# EAGLE design FrontPanel-IN14 (EAGLE 9.5.1)
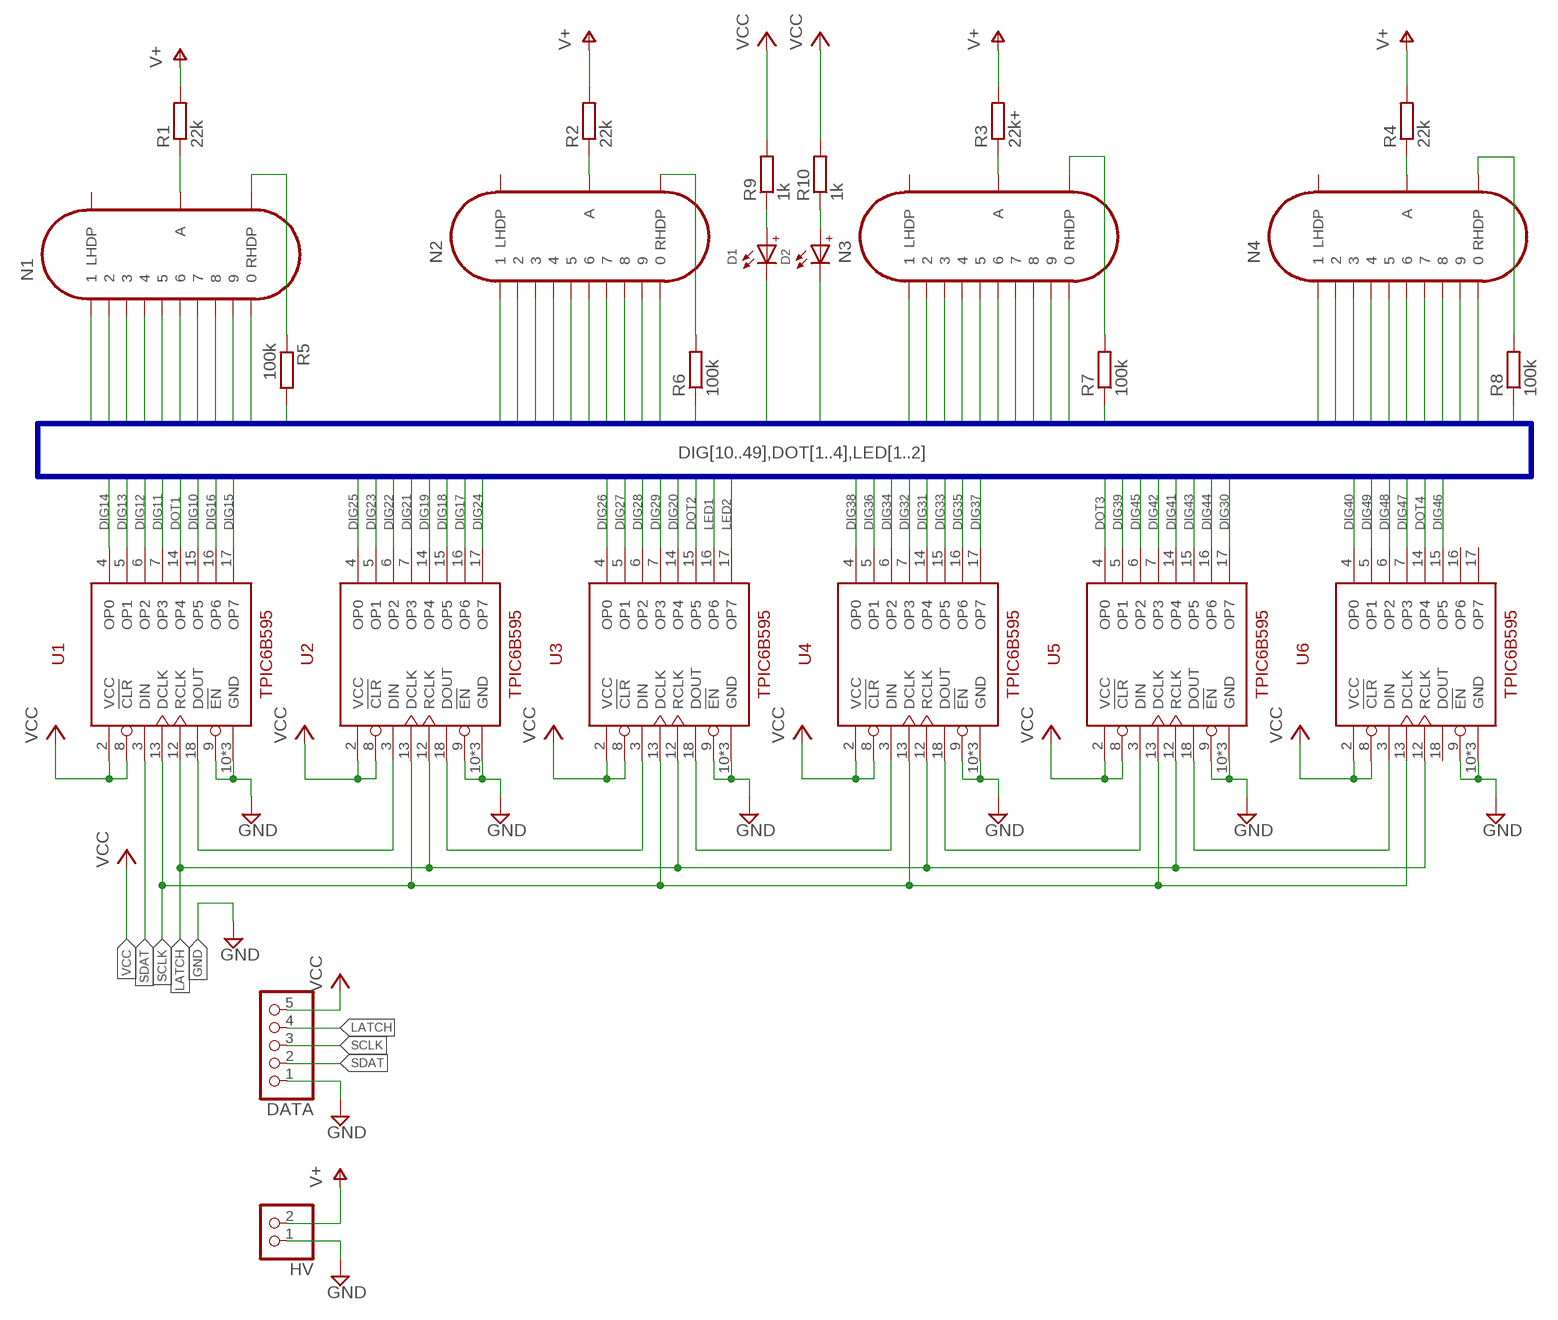
[diagram p0: schematic, sheet 1]

## Parts
D1  RED/AMBER  WL-SITW_3528_15414185BA210  [WL-SITW_154141XXBA210]
D2  RED/AMBER  WL-SITW_3528_15414185BA210  [WL-SITW_154141XXBA210]
DATA  .1" Header  PINHD-1X5  [1X05]
HV  .1" Header  PINHD-1X2  [1X02]
N1  IN-14  [IN-14]
N2  IN-14  [IN-14]
N3  IN-14  [IN-14]
N4  IN-14  [IN-14]
R1  22k  R-EU_0207/10  [0207/10]
R2  22k  R-EU_0207/10  [0207/10]
R3  22k+  R-EU_0207/10  [0207/10]
R4  22k  R-EU_0207/10  [0207/10]
R5  100k  R-EU_0207/10  [0207/10]
R6  100k  R-EU_0207/10  [0207/10]
R7  100k  R-EU_0207/10  [0207/10]
R8  100k  R-EU_0207/10  [0207/10]
R9  1k  R-EU_0207/10  [0207/10]
R10  1k  R-EU_0207/10  [0207/10]
U1  TPIC6B595N  [PDIP-20]
U2  TPIC6B595N  [PDIP-20]
U3  TPIC6B595N  [PDIP-20]
U4  TPIC6B595N  [PDIP-20]
U5  TPIC6B595N  [PDIP-20]
U6  TPIC6B595N  [PDIP-20]

## Nets
DIG10: N1.0 U1.15(OP5)
DIG11: N1.1 U1.7(OP3)
DIG12: N1.2 U1.6(OP2)
DIG13: N1.3 U1.5(OP1)
DIG14: N1.4 U1.4(OP0)
DIG15: N1.5 U1.17(OP7)
DIG16: N1.6 U1.16(OP6)
DIG17: N1.7 U2.16(OP6)
DIG18: N1.8 U2.15(OP5)
DIG19: N1.9 U2.14(OP4)
DIG20: N2.0 U3.14(OP4)
DIG21: N2.1 U2.7(OP3)
DIG22: N2.2 U2.6(OP2)
DIG23: N2.3 U2.5(OP1)
DIG24: N2.4 U2.17(OP7)
DIG25: N2.5 U2.4(OP0)
DIG26: N2.6 U3.4(OP0)
DIG27: N2.7 U3.5(OP1)
DIG28: N2.8 U3.6(OP2)
DIG29: N2.9 U3.7(OP3)
DIG30: N3.0 U5.17(OP7)
DIG31: N3.1 U4.14(OP4)
DIG32: N3.2 U4.7(OP3)
DIG33: N3.3 U4.15(OP5)
DIG34: N3.4 U4.6(OP2)
DIG35: N3.5 U4.16(OP6)
DIG36: N3.6 U4.5(OP1)
DIG37: N3.7 U4.17(OP7)
DIG38: N3.8 U4.4(OP0)
DIG39: N3.9 U5.5(OP1)
DIG40: N4.0 U6.4(OP0)
DIG41: N4.1 U5.14(OP4)
DIG42: N4.2 U5.7(OP3)
DIG43: N4.3 U5.15(OP5)
DIG44: N4.4 U5.16(OP6)
DIG45: N4.5 U5.6(OP2)
DIG46: N4.6 U6.15(OP5)
DIG47: N4.7 U6.7(OP3)
DIG48: N4.8 U6.6(OP2)
DIG49: N4.9 U6.5(OP1)
DOT1: R5.2 U1.14(OP4)
DOT2: R6.1 U3.15(OP5)
DOT3: R7.1 U5.4(OP0)
DOT4: R8.1 U6.14(OP4)
GND: DATA.1 HV.1 U1.9(!EN) U1.10(GND) U1.11(GND) U1.19(GND) U2.9(!EN) U2.10(GND) U2.11(GND) U2.19(GND) U3.9(!EN) U3.10(GND) U3.11(GND) U3.19(GND) U4.9(!EN) U4.10(GND) U4.11(GND) U4.19(GND) U5.9(!EN) U5.10(GND) U5.11(GND) U5.19(GND) U6.9(!EN) U6.10(GND) U6.11(GND) U6.19(GND)
LATCH: DATA.4 U1.12(RCLK) U2.12(RCLK) U3.12(RCLK) U4.12(RCLK) U5.12(RCLK) U6.12(RCLK)
LED1: D1.2(-) U3.16(OP6)
LED2: D2.2(-) U3.17(OP7)
N$45: N1.RHDP R5.1
N$46: N2.RHDP R6.2
N$47: N3.RHDP R7.2
N$48: N4.RHDP R8.2
N$49: N1.A R1.1
N$50: N2.A R2.1
N$51: N3.A R3.1
N$52: N4.A R4.1
N$55: U1.18(DOUT) U2.3(DIN)
N$56: U2.18(DOUT) U3.3(DIN)
N$57: U3.18(DOUT) U4.3(DIN)
N$58: U4.18(DOUT) U5.3(DIN)
N$59: U5.18(DOUT) U6.3(DIN)
N$66: D1.1(+) R9.1
N$67: D2.1(+) R10.1
SCLK: DATA.3 U1.13(DCLK) U2.13(DCLK) U3.13(DCLK) U4.13(DCLK) U5.13(DCLK) U6.13(DCLK)
SDAT: DATA.2 U1.3(DIN)
V+: HV.2 R1.2 R2.2 R3.2 R4.2
VCC: DATA.5 R9.2 R10.2 U1.2(VCC) U1.8(!CLR) U2.2(VCC) U2.8(!CLR) U3.2(VCC) U3.8(!CLR) U4.2(VCC) U4.8(!CLR) U5.2(VCC) U5.8(!CLR) U6.2(VCC) U6.8(!CLR)
Unconnected: N1.LHDP N2.LHDP N3.LHDP N4.LHDP U6.16(OP6) U6.17(OP7) U6.18(DOUT)

## Buses
DIG[10..49],DOT[1..4],LED[1..2]

## Library data of the parts
D1 D2 = Wurth_Elektronik_Optoelectronics_rev18a:WL-SITW_3528: WL-SITW SMD Infrared TOP LED Waterclear Characteristics Standard size 3528 Low energy consumption High reliability Low current requirement Fast switching IR Emitter Applications Infrared sensor Distance measure Remote control IR Lightbarrier Smoke detector <http://katalog.we-online.de/media/images/v2/Family_SITW-3528_15414185BA220.jpg> Details see: http://katalog.we-online.de/en/led/WL-SITW?m Created By Yingchun Shan 2018-03-09 2018 (C) Wurth Elektronik
DATA = pinhead:PINHD-1X5: PIN HEADER
HV = pinhead:PINHD-1X2: PIN HEADER
N1-N4 = NixieClock:IN-14: IN-14: medium numeric frontview nixie tube
R1-R10 = rcl:R-EU_: RESISTOR, European symbol; SPICEPREFIX: R
U1-U6 = NixieClock:TPIC6B595

## Board
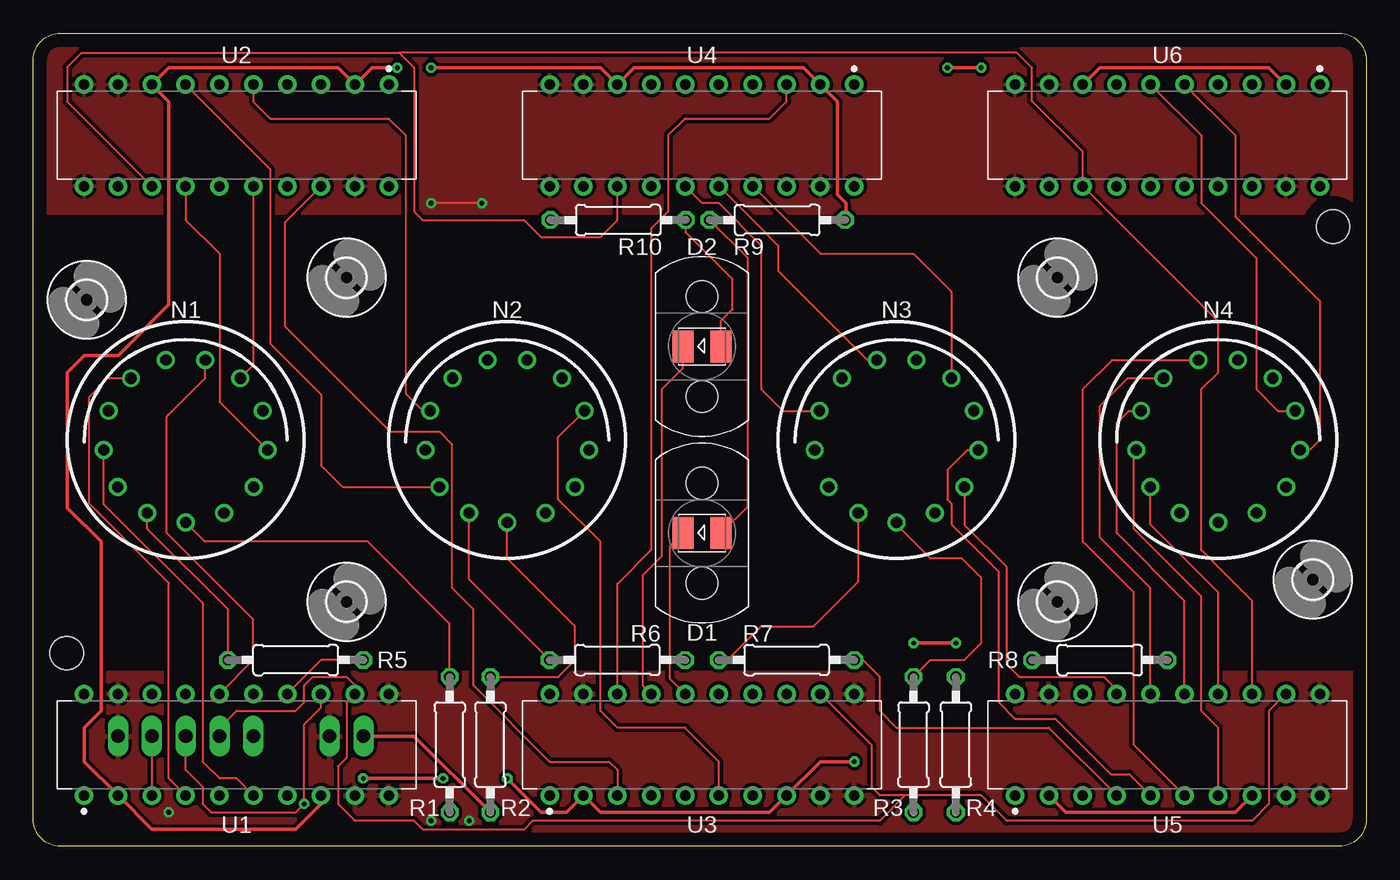
[diagram p1: board, top side]
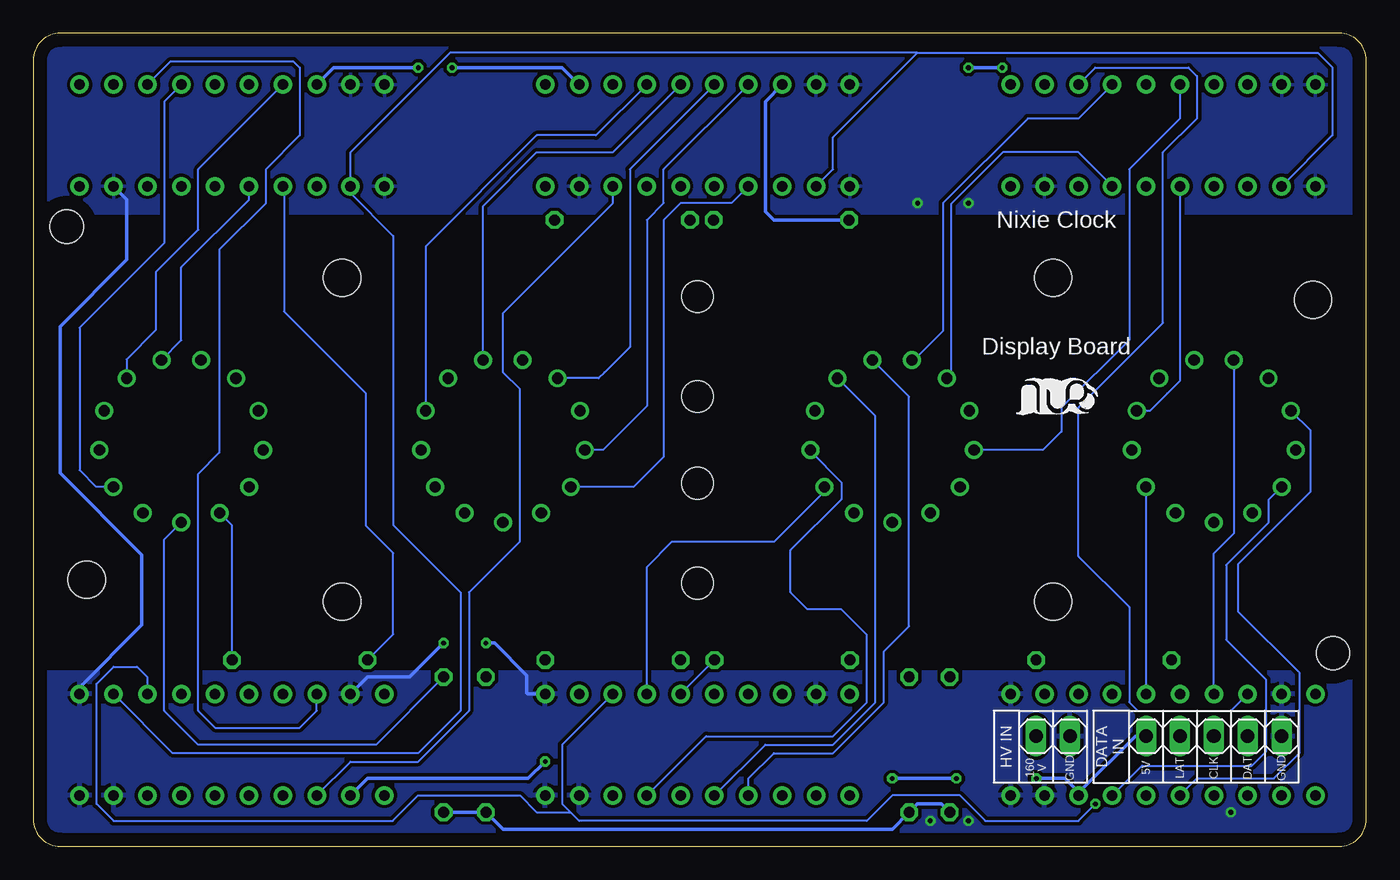
[diagram p2: board, bottom side, seen from below]

Size 100 x 61 mm. Coordinates in mm from the lower left corner, seen from the top.
Outline: 2,0 arc-90 0,2 0,59 arc-90 2,61 98,61 arc-90 100,59 100,2 arc-90 98,0 2,0
Copper layers (1*16): Top 0.035mm / dielectric 1.5mm / Bottom 0.035mm
Design rules "2layer": minimum track width 6mil, minimum drill 0.35mm, track to track 8mil, track to pad 8mil, pad to pad 8mil, via to via 8mil, smd to smd 6mil, copper to edge 40mil, drill to drill 6mil, minimum pad ring 10mil, minimum via ring 8mil, stop-mask expansion 4mil, vias tented up to drill 40mil, thermal gap 10mil
Holes 2.5 mm at 97.5,46.5 2.5,14.5

### Footprints (pad centres in the part's own frame; a part is rotated, then mirrored left to right if it is on the bottom)
WL-SITW_154141XXBA210 = smd 1.6 x 2.4: 1 -1.425,0; 2 1.425,0
1X05 = drill 1.016 long: 1 -5.08,0; 2 -2.54,0; 3 0,0; 4 2.54,0; 5 5.08,0
1X02 = drill 1.016 long: 1 -1.27,0; 2 1.27,0
IN-14 = drill 0.84: 0 5.094,-3.516; 1 -5.094,-3.516; 2 -6.145,-0.746; 3 -5.788,2.195; 4 -4.105,4.633; 5 -1.481,6.01; 6 1.481,6.01; 7 4.105,4.633; 8 5.788,2.195; 9 6.145,-0.746; A 0,-6.19; LHDP 2.877,-5.481; RHDP -2.877,-5.481
0207/10 = drill 0.813 octagon: 1 -5.08,0; 2 5.08,0
PDIP-20 = drill 0.786 pad 1.386: 1 -3.81,11.43; 2 -3.81,8.89; 3 -3.81,6.35; 4 -3.81,3.81; 5 -3.81,1.27; 6 -3.81,-1.27; 7 -3.81,-3.81; 8 -3.81,-6.35; 9 -3.81,-8.89; 10 -3.81,-11.43; 11 3.81,-11.43; 12 3.81,-8.89; 13 3.81,-6.35; 14 3.81,-3.81; 15 3.81,-1.27; 16 3.81,1.27; 17 3.81,3.81; 18 3.81,6.35; 19 3.81,8.89; 20 3.81,11.43
2,8 = hole 2.8: 0,0
MENTOR-1216.1005 = hole 2.4: -3.75,0; 3.75,0

### Placement (x,y rotation side)
D1  50.16,23.5 180 top
D2  50.16,37.5 180 top
DATA  11.43,8.26 180 bottom
HV  23.5,8.26 180 bottom
N1  11.43,30.48 0 top
N2  35.56,30.48 0 top
N3  64.77,30.48 0 top
N4  88.9,30.48 0 top
R1  31.24,7.62 270 top
R2  34.29,7.62 270 top
R3  66.04,7.62 270 top
R4  69.22,7.62 270 top
R5  19.68,13.97 0 top
R6  43.81,13.97 180 top
R7  56.52,13.97 180 top
R8  80.01,13.97 0 top
R9  55.81,46.99 0 top
R10  43.88,46.99 180 top
U1  15.24,7.62 90 top
U2  15.24,53.34 270 top
U3  50.16,7.62 90 top
U4  50.16,53.34 270 top
U5  85.09,7.62 90 top
U6  85.09,53.34 270 top
U$1  [2,8]  23.5,42.66 0 top
U$2  [2,8]  4,41 0 top
U$3  [2,8]  23.5,18.34 0 top
U$4  [LOGO-SILKSCREEEN-S]  23.25,33.25 0 bottom
U$5  [MENTOR-1216.1005]  50.16,37.5 90 top
U$6  [MENTOR-1216.1005]  50.16,23.5 90 top
U$7  [2,8]  76.83,18.34 0 top
U$8  [2,8]  76.83,42.66 0 top
U$9  [2,8]  96,20 0 top

### Tracks (layer width: path | path; a pad name or v marks a point on that pad's centre or on a via)
DIG10
  Bottom 0.152: N1.0 U1.15
DIG11
  Bottom 0.152: U1.7 16.83,6.03 8.6,6.03 7.5,7.13 7.5,12.5 10.5,15.5 10.5,21.1 7.34,24.26 7.34,25.96 N1.1
DIG12
  Top 0.152: U1.6 15.24,5.08 13.97,5.08 12.7,6.35 12.7,18.24 5.29,25.66 N1.2
DIG13
  Bottom 0.152: U1.5 12.7,5.08 6.92,5.08 5,7 5,13 9.58,17.58 9.58,21.2 4.17,26.61 4.17,31.21 N1.3
DIG14
  Top 0.152: U1.4 10.16,5.08 10.16,19.74 4.17,25.73 4.17,33.7 5.59,35.11 N1.4
DIG15
  Bottom 0.152: U1.17 11.43,21.97 9.95,23.45 N1.5
DIG16
  Top 0.152: N1.6 12.91,35.14 10.39,32.61 10.16,32.38 10,32.23 10,23.52 16.51,17.01 16.51,13.97 U1.16
DIG17
  Top 0.152: U2.16 16.51,36.09 N1.7
DIG18
  Bottom 0.152: U2.15 13.97,34.92 14.92,33.97 | N1.8 16.22,32.67 14.92,33.97 | 14.92,33.97
DIG19
  Top 0.152: U2.14 11.43,46.99 13.97,44.45 13.97,33.34 N1.9
DIG20
  Bottom 0.152: U3.14 53.98,20.95 52.07,22.86 44.45,22.86 44.44,22.85 40.65,26.64 N2.0
DIG21
  Top 0.152: U2.7 17.78,50.8 17.78,37.72 21.59,33.91 21.59,28.57 23.2,26.96 N2.1
DIG22
  Bottom 0.152: U2.6 13.97,54.61 17.78,50.8 17.78,37.99 22.86,32.91 22.86,31.11 24.24,29.73 N2.2
DIG23
  Top 0.152: U2.5 16.51,55.88 17.78,54.61 26.67,54.61 27.94,53.34 27.94,33.97 29.24,32.67 N2.3
DIG24
  Bottom 0.152: U2.17 21.59,52.07 27.27,52.07 31.11,48.23 31.11,35.45 N2.4
DIG25
  Bottom 0.152: U2.4 21.59,54.61 25.4,54.61 31.75,48.26 31.75,38.67 33.93,36.49 N2.5
DIG26
  Bottom 0.152: U3.4 46.35,5.08 44.45,6.99 40.01,6.99 36.2,10.79 36.2,14.61 34.29,16.51 34.29,33.74 N2.6
DIG27
  Bottom 0.152: U3.5 45.09,7.62 40.01,7.62 36.83,10.79 36.83,32.28 N2.7
DIG28
  Top 0.152: U3.6 51.44,6.35 48.9,8.89 43.81,8.89 42.55,10.16 42.55,22.86 39.37,26.04 39.37,30.7 N2.8
DIG29
  Bottom 0.152: U3.7 49.53,8.26 40.01,8.26 37.47,10.79 37.47,15.88 39.37,17.78 41.91,17.78 43.18,19.05 43.18,22.23 39.37,26.04 39.37,27.3 41.7,29.64 N2.9
DIG30
  Top 0.152: U5.17 81.28,11.75 80.33,12.7 73.98,12.7 73.03,13.65 73.03,20.95 69.86,24.12 N3.0
DIG31
  Bottom 0.152: U4.14 47.62,48.26 51.44,48.26 52.7,46.99 52.7,29.21 54.95,26.96 N3.1
DIG32
  Bottom 0.152: U4.7 52.7,50.8 52.7,48.26 53.98,46.99 53.98,33.02 57.26,29.73 N3.2
DIG33
  Top 0.152: U4.15 50.16,48.26 51.44,48.26 54.61,45.09 54.61,34.29 56.23,32.67 N3.3
DIG34
  Bottom 0.152: U4.6 55.24,50.8 55.24,37.47 57.15,35.56 57.59,35.12 57.6,35.11 N3.4
DIG35
  Top 0.152: U4.16 54.29,46.67 55.88,45.09 55.88,43.18 62.57,36.49 N3.5
DIG36
  Bottom 0.152: U4.5 56.52,52.07 62.23,52.07 66.25,48.05 N3.6
DIG37
  Top 0.152: U4.17 59.05,44.45 66.04,44.45 68.88,41.62 N3.7
DIG38
  Bottom 0.152: U4.4 57.78,53.34 62.23,53.34 70.56,45.01 N3.8
DIG39
  Top 0.152: N3.9 70.09,29.73 68.58,28.22 68.58,26.04 68.9,25.72 68.9,24.13 72.39,20.64 72.39,10.83 73.66,9.56 76.67,9.56 80.83,5.4 82.23,5.4 U5.5
DIG40
  Bottom 0.152: U6.4 90.17,55.88 90.17,45.26 96.52,38.91 96.52,28.22 95.26,26.96 N4.0
DIG41
  Top 0.152: U5.14 88.9,19.05 83.81,24.14 N4.1
DIG42
  Top 0.152: U5.7 88.9,8.89 87.63,10.16 87.63,18.73 82.55,23.81 82.55,29.53 N4.2
DIG43
  Top 0.152: U5.15 86.36,18.41 81.28,23.5 81.28,31.75 82.2,32.67 N4.3
DIG44
  Top 0.152: U5.16 83.82,19.37 80.01,23.18 80.01,33.02 82.1,35.11 N4.4
DIG45
  Top 0.152: U5.6 82.55,7.62 82.55,19.05 78.74,22.86 78.74,34.29 80.94,36.49 N4.5
DIG46
  Bottom 0.152: U6.15 83.82,48.53 88.9,43.45 88.9,37.97 N4.6
DIG47
  Bottom 0.152: U6.7 87.63,50.8 87.63,46.26 90.81,43.09 90.81,38.73 93,36.53 N4.7
DIG48
  Top 0.152: U6.6 87.63,53.34 87.63,48.26 91.76,44.13 91.76,34.29 93.37,32.67 N4.8
DIG49
  Top 0.152: U6.5 90.17,53.34 90.17,47.26 96.52,40.91 96.52,30.48 95.77,29.73 N4.9
DOT1
  Top 0.152: R5.2 21.59,13.97 U1.14
DOT2
  Bottom 0.152: U3.15 R6.1
DOT3
  Top 0.152: R7.1 62.23,13.97 63.5,12.7 63.5,10.16 64.77,8.89 76.2,8.89 U5.4
DOT4
  Bottom 0.152: U6.14 81.2,49.45 81.2,40.13 75.03,33.97 75.03,24.04 73,22 73,15.9 R8.1
GND  (via drill 0.35)
  Top 0.152: v33.66,48.26 v29.84,48.26
  Top 0.254: v69.22,15.24 v66.04,15.24
  Bottom 0.254: v66.04,15.24 65.41,15.24 63,12.84 63,11.5 62.93,11.43 U3.11 | v69.22,15.24 71.75,12.7 74.93,12.7 U5.19 | U5.11 96.52,11.93 91.86,16.59 91.86,21.86 98,28 98,39 92.98,44.02 92.98,48.53 U6.19
  other vias: 29.84,1.91 32.7,1.91 10.16,2.54
  pour Top (isolate 0.254): 0,0 0,13 100,13 100,0
  pour Top (isolate 0.254): 0,61 0,47.5 100,47.5 100,61
  pour Bottom (isolate 0.254): 0,61 0,47.5 100,47.5 100,61
  pour Bottom (isolate 0.254): 0,0 0,13 100,13 100,0
LATCH
  Top 0.152: U3.12 62.87,7.62 62.87,4.45 63.5,3.81 65.41,3.81 | U5.12 92.71,10.16 92.71,3.17 91.44,1.91 73.03,1.91 71.12,3.81 65.41,3.81 | 65.41,3.81 63.5,1.91 37.47,1.91 36.81,1.25 29.23,1.25 28.57,1.91 24.13,1.91 22.86,3.17 22.86,6 23.5,6.63 23.5,10.79 U1.12 24.13,12.06 23.5,12.7 20.95,12.7 20.32,12.06 20.32,10.79 19.68,10.16 15.24,10.16 13.97,8.89 DATA.4
  Bottom 0.152: U2.12 2.54,53.34 2.54,58.45 3.62,59.54 33.66,59.54 | U4.12 40.01,50.8 40.01,53.19 33.66,59.54 | U5.12 89.53,6.99 71.12,6.99 67.94,10.16 67.94,19.05 73,24.11 73,45.79 76.2,48.99 U6.12 76.2,52.07 68.73,59.54 33.66,59.54
LED1
  Top 0.152: D1.2 47.74,22.5 47.74,12.59 U3.16
LED2
  Top 0.152: U3.17 45.72,12.06 45.72,20.32 47.16,21.77 47.16,34.29 48.74,35.87 D2.2
N$45
  Top 0.152: N1.RHDP 8.55,23.82 14.61,17.77 R5.1
N$46
  Top 0.152: N2.RHDP 32.68,20.02 R6.2
N$47
  Top 0.152: R7.2 52.07,13.97 54.61,16.51 58.53,16.51 61.89,19.87 N3.RHDP
N$48
  Bottom 0.152: N4.RHDP 85.09,24.07 R8.2
N$49
  Top 0.152: R1.1 31.24,16.7 25.08,22.86 12.86,22.86 N1.A
N$50
  Top 0.152: R2.1 39.37,12.7 40.64,13.97 40.64,16.51 35.56,21.59 N2.A
N$51
  Top 0.152: R3.1 67.31,13.97 69.85,13.97 71.12,15.24 71.12,20.13 69.66,21.59 67.31,21.59 64.77,24.13 N3.A
N$52
  Bottom 0.152: R4.1 74.3,7.62 87.63,7.62 90.17,10.16 90.17,23.02 N4.A
N$55
  Bottom 0.152: U2.3 20.32,58.42 13.34,58.42 12.7,57.78 12.7,54.61 15.24,52.07 15.24,39.26 21.59,32.91 21.59,21.76 17.78,17.95 17.78,10.79 17.14,10.16 10.16,10.16 U1.18
N$56
  Top 0.152: U2.18 18.86,46.8 18.86,39.02 26.77,31.11 30.48,31.11 31.43,30.16 31.43,19.37 33.02,17.78 33.02,12.06 38.73,6.35 43.18,6.35 43.81,5.71 U3.3
N$57
  Top 0.152: U3.18 43.81,19.68 46.35,22.23 46.35,46.35 47.62,47.62 47.62,53.34 48.9,54.61 55.24,54.61 56.52,55.88 U4.3
N$58
  Bottom 0.152: U5.3 76.2,6.35 71.12,6.35 67.31,10.16 67.31,19.05 63.5,22.86 63.5,34.29 64.77,35.56 64.77,40.01 56.52,48.26 U4.18
N$59
  Bottom 0.152: U6.3 89.69,58.9 80.49,58.9 80.01,58.42 80.01,53.34 82.55,50.8 82.55,48.26 86.04,44.77 86.04,29.53 87.63,27.94 87.63,10.16 86.36,8.89 80.01,8.89 78.74,10.16 U5.18
N$66
  Top 0.152: D1.1 53.56,25.47 53.56,44.16 R9.1
N$67
  Top 0.152: D2.1 51.59,39.43 52.46,40.3 52.46,42.54 48.96,46.04 R10.1
SCLK  (via drill 0.35)
  Top 0.152: U2.13 2.54,55.88 2.54,58.45 3.62,59.54 27.46,59.54 | U5.13 91.44,18.41 87.63,22.23 87.63,34.29 88.9,35.56 88.9,39.37 U6.13 78.74,52.1 74.96,55.88 74.93,55.88 74.93,58.42 73.81,59.54 27.46,59.54 | 27.46,59.54 28.57,58.42 28.57,47.62 29.21,46.99 36.83,46.99 38.1,45.72 42.55,45.72 43.81,46.99 U4.13 | U1.13 21.59,10.43 20.32,9.16 v20.32,3.17 19.68,2.54 13.34,2.54 12.7,3.17 12.7,4.45 11.43,5.71 DATA.3
  Bottom 0.152: 59.69,2.54 59.05,1.91 37.47,1.91 35.56,3.81 30.48,3.81 28.57,1.91 21.59,1.91 v20.32,3.17 | 59.69,2.54 60.33,3.17 60.33,7.62 U3.13 | 59.69,2.54 62.23,2.54 63.5,3.81 71.12,3.81 73.03,1.91 93.98,1.91 95.25,3.17 95.25,12.2 93.98,13.47 92.21,13.47 91.44,12.7 U5.13
SDAT
  Top 0.152: DATA.2 U1.3
V+
  Top 0.254: HV.2 28.57,8.26 R2.2
  Bottom 0.254: R1.2 31.88,3.17 33.66,3.17 R2.2 35.56,1.27 64.77,1.27 R3.2 R4.2
VCC  (via drill 0.35)
  Top 0.254: U6.8 80.01,58.42 92.71,58.42 U6.2 | v68.58,58.42 v71.12,58.42 | v27.3,58.42 25.4,58.42 U2.2 22.86,58.42 10.16,58.42 U2.8 10.16,55.88 10.16,40.64 6.35,36.83 3.81,36.83 2.54,35.56 2.54,25.4 5.08,22.86 5.08,10.16 3.81,8.89 3.81,6.35 U1.2 8.89,1.27 19.68,1.27 21.59,3.17 U1.8 | v29.84,58.42 42.55,58.42 U4.8 45.09,58.42 57.78,58.42 U4.2 60.33,55.88 60.33,48.9 60.96,48.26 60.96,47.05 R9.2 | v35.56,5.08 38.1,2.54 40.01,2.54 U3.2 42.55,2.54 55.24,2.54 U3.8 59.05,6.35 v61.59,6.35 | U5.2 77.47,2.54 90.17,2.54 U5.8 | v24.75,5.08 v30.75,5.08
  Bottom 0.254: U4.8 45.09,55.88 45.09,47.62 44.45,46.99 R10.2 | U4.2 60.33,58.42 v68.58,58.42 | U6.8 77.47,58.42 v71.12,58.42 | v27.3,58.42 v29.84,58.42 | v61.59,6.35 62.87,5.08 74.93,5.08 U5.2 | DATA.5 17.34,8.26 21.59,4 U1.8 21.59,4.08 22.59,5.08 v24.75,5.08 | v35.56,5.08 v30.75,5.08

### Text on the board
bPlace: Nixie Clock | Display Board | DATA / IN | HV IN | GND | DAT | CLK | LAT | 5V | GND | 160 / V